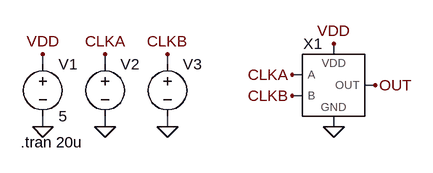
[diagram p0: schematic NANDTB.asc]
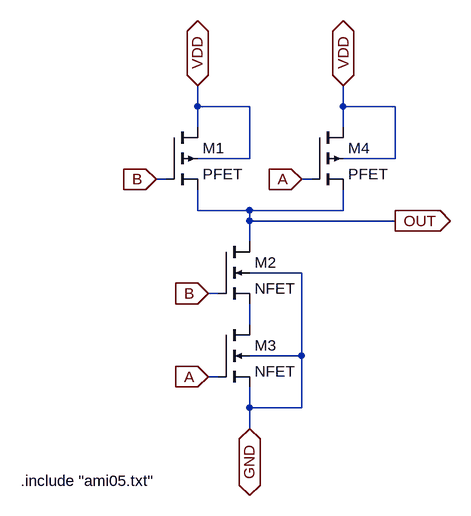
[diagram p1: sub-circuit nand.asc]
NANDTB.asc, the LTspice schematic file:
Version 4
SHEET 1 880 680
WIRE 224 96 224 80
WIRE -224 112 -224 96
WIRE -128 112 -128 96
WIRE -32 112 -32 96
WIRE 176 128 160 128
WIRE 288 144 272 144
WIRE 176 160 160 160
WIRE -224 208 -224 192
WIRE -128 208 -128 192
WIRE -32 208 -32 192
WIRE 224 208 224 192
FLAG 224 80 VDD
FLAG 224 208 0
FLAG 288 144 OUT
FLAG 160 128 CLKA
FLAG 160 160 CLKB
FLAG -224 208 0
FLAG -128 208 0
FLAG -32 208 0
FLAG -128 96 CLKA
FLAG -32 96 CLKB
FLAG -224 96 VDD
SYMBOL voltage -224 96 R0
WINDOW 123 0 0 Left 0
WINDOW 39 0 0 Left 0
SYMATTR InstName V1
SYMATTR Value 5
SYMBOL voltage -128 96 R0
WINDOW 3 24 96 Invisible 2
WINDOW 123 0 0 Left 0
WINDOW 39 0 0 Left 0
SYMATTR Value PULSE(0 5 0 1n 1n 10u 20u)
SYMATTR InstName V2
SYMBOL voltage -32 96 R0
WINDOW 3 24 96 Invisible 2
WINDOW 123 0 0 Left 0
WINDOW 39 0 0 Left 0
SYMATTR Value PULSE(0 5 0 1n 1n 5u 10u)
SYMATTR InstName V3
SYMBOL NAND 224 144 R0
SYMATTR InstName X1
TEXT -258 232 Left 2 !.tran 20u

nand.asc, the sub-circuit schematic file:
Version 4
SHEET 1 880 680
WIRE 32 -96 32 -128
WIRE 112 -96 32 -96
WIRE 256 -96 256 -128
WIRE 336 -96 256 -96
WIRE 32 -64 32 -96
WIRE 256 -64 256 -96
WIRE 112 -16 112 -96
WIRE 112 -16 32 -16
WIRE 336 -16 336 -96
WIRE 336 -16 256 -16
WIRE -16 16 -32 16
WIRE 208 16 192 16
WIRE 32 64 32 32
WIRE 112 64 32 64
WIRE 256 64 256 32
WIRE 256 64 112 64
WIRE 112 80 112 64
WIRE 336 80 112 80
WIRE 112 112 112 80
WIRE 192 160 112 160
WIRE 64 192 48 192
WIRE 112 240 112 208
WIRE 192 288 192 160
WIRE 192 288 112 288
WIRE 64 320 48 320
WIRE 112 368 112 336
WIRE 192 368 192 288
WIRE 192 368 112 368
WIRE 112 400 112 368
FLAG 112 400 GND
IOPIN 112 400 BiDir
FLAG 32 -128 VDD
IOPIN 32 -128 BiDir
FLAG 256 -128 VDD
IOPIN 256 -128 BiDir
FLAG 192 16 A
IOPIN 192 16 In
FLAG 48 320 A
IOPIN 48 320 In
FLAG 48 192 B
IOPIN 48 192 In
FLAG -32 16 B
IOPIN -32 16 In
FLAG 336 80 OUT
IOPIN 336 80 Out
SYMBOL pmos4 -16 -64 R0
SYMATTR InstName M1
SYMATTR Value2 l=600n w=3u
SYMATTR Value PFET
SYMBOL nmos4 64 112 R0
SYMATTR InstName M2
SYMATTR Value2 l=600n w=3u
SYMATTR Value NFET
SYMBOL nmos4 64 240 R0
SYMATTR InstName M3
SYMATTR Value2 l=600n w=3u
SYMATTR Value NFET
SYMBOL pmos4 208 -64 R0
SYMATTR InstName M4
SYMATTR Value2 l=600n w=3u
SYMATTR Value PFET
TEXT -240 480 Left 2 !.include "ami05.txt"

The netlist it stands for:
* NANDTB.asc
V1 VDD 0 5
V2 CLKA 0 PULSE(0 5 0 1n 1n 10u 20u)
V3 CLKB 0 PULSE(0 5 0 1n 1n 5u 10u)
XX1 CLKA CLKB 0 OUT VDD nand

* block symbol definitions
.subckt nand A B GND OUT VDD
M1 VDD B OUT VDD PFET l=600n w=3u
M2 OUT B N001 GND NFET l=600n w=3u
M3 N001 A GND GND NFET l=600n w=3u
M4 VDD A OUT VDD PFET l=600n w=3u
.include "ami05.txt"
.ends nand

.model NMOS NMOS
.model PMOS PMOS
.lib standard.mos
.tran 20u
.backanno
.end